# Altium schematic sheet DC-DC TPS564208DDCT.SchDoc
size A3
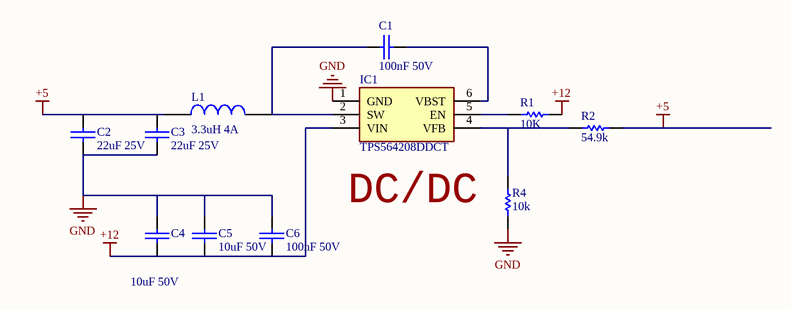
[diagram p0: DC-DC TPS564208DDCT.SchDoc]

## Parts
C1  100nF 50V  [0402C]
C2  22uF 25V  [0805C]
C3  22uF 25V  [0805C]
C4  10uF 50V  [0805C]
C5  10uF 50V  [0805C]
C6  100nF 50V  [0402C]
IC1  TPS564208DDCT  [SOT95P280X110-6N]
L1  3.3uH 4A  [SMD4.3*4*2]
R1  10K  [0402R]
R2  54.9k  [0402R]
R4  10k  [0402R]

## Nets
+5: C2.2 C3.2 L1.1 R2.2
+12: C4.1 C5.1 C6.1 IC1.3(VIN) R1.2
GND: C2.1 C3.1 C4.2 C5.2 C6.2 IC1.1(GND) R4.1
NetC1_1: C1.1 IC1.2(SW) L1.2
NetC1_2: C1.2 IC1.6(VBST)
NetIC1_4: IC1.4(VFB) R2.1 R4.2
NetIC1_5: IC1.5(EN) R1.1

## Notes on the sheet
- DC/DC

## Library data of the parts
C1-C6 = CAP-NP
IC1 = TPS564208DDCT: Integrated Circuit; Manufacturer_Name: Texas Instruments; Datasheet Link: http://www.ti.com/lit/ds/symlink/tps564208.pdf; Height: 1.1mm; Manufacturer_Part_Number: TPS564208DDCT; Mouser Part Number: 595-TPS564208DDCT; Mouser Price/Stock: https://www.mouser.com/Search/Refine.aspx?Keyword=595-TPS564208DDCT; RS Part Number: 1330753P; RS Price/Stock: http://uk.rs-online.com/web/p/products/1330753P; ComponentLink1Description: LCSC; ComponentLink1URL: https://item.szlcsc.com/494549.html; ComponentLink2Description: PDF; ComponentLink2URL: file:///C:/Users/58218/Downloads/C486062_TPS564208DDCR_2020-01-18%20(1).PDF
L1 = INDUCTOR: CMLF0504-3R3MTT
R1 R2 R4 = RES